# EAGLE design SMART4 (EAGLE 8.6.0)
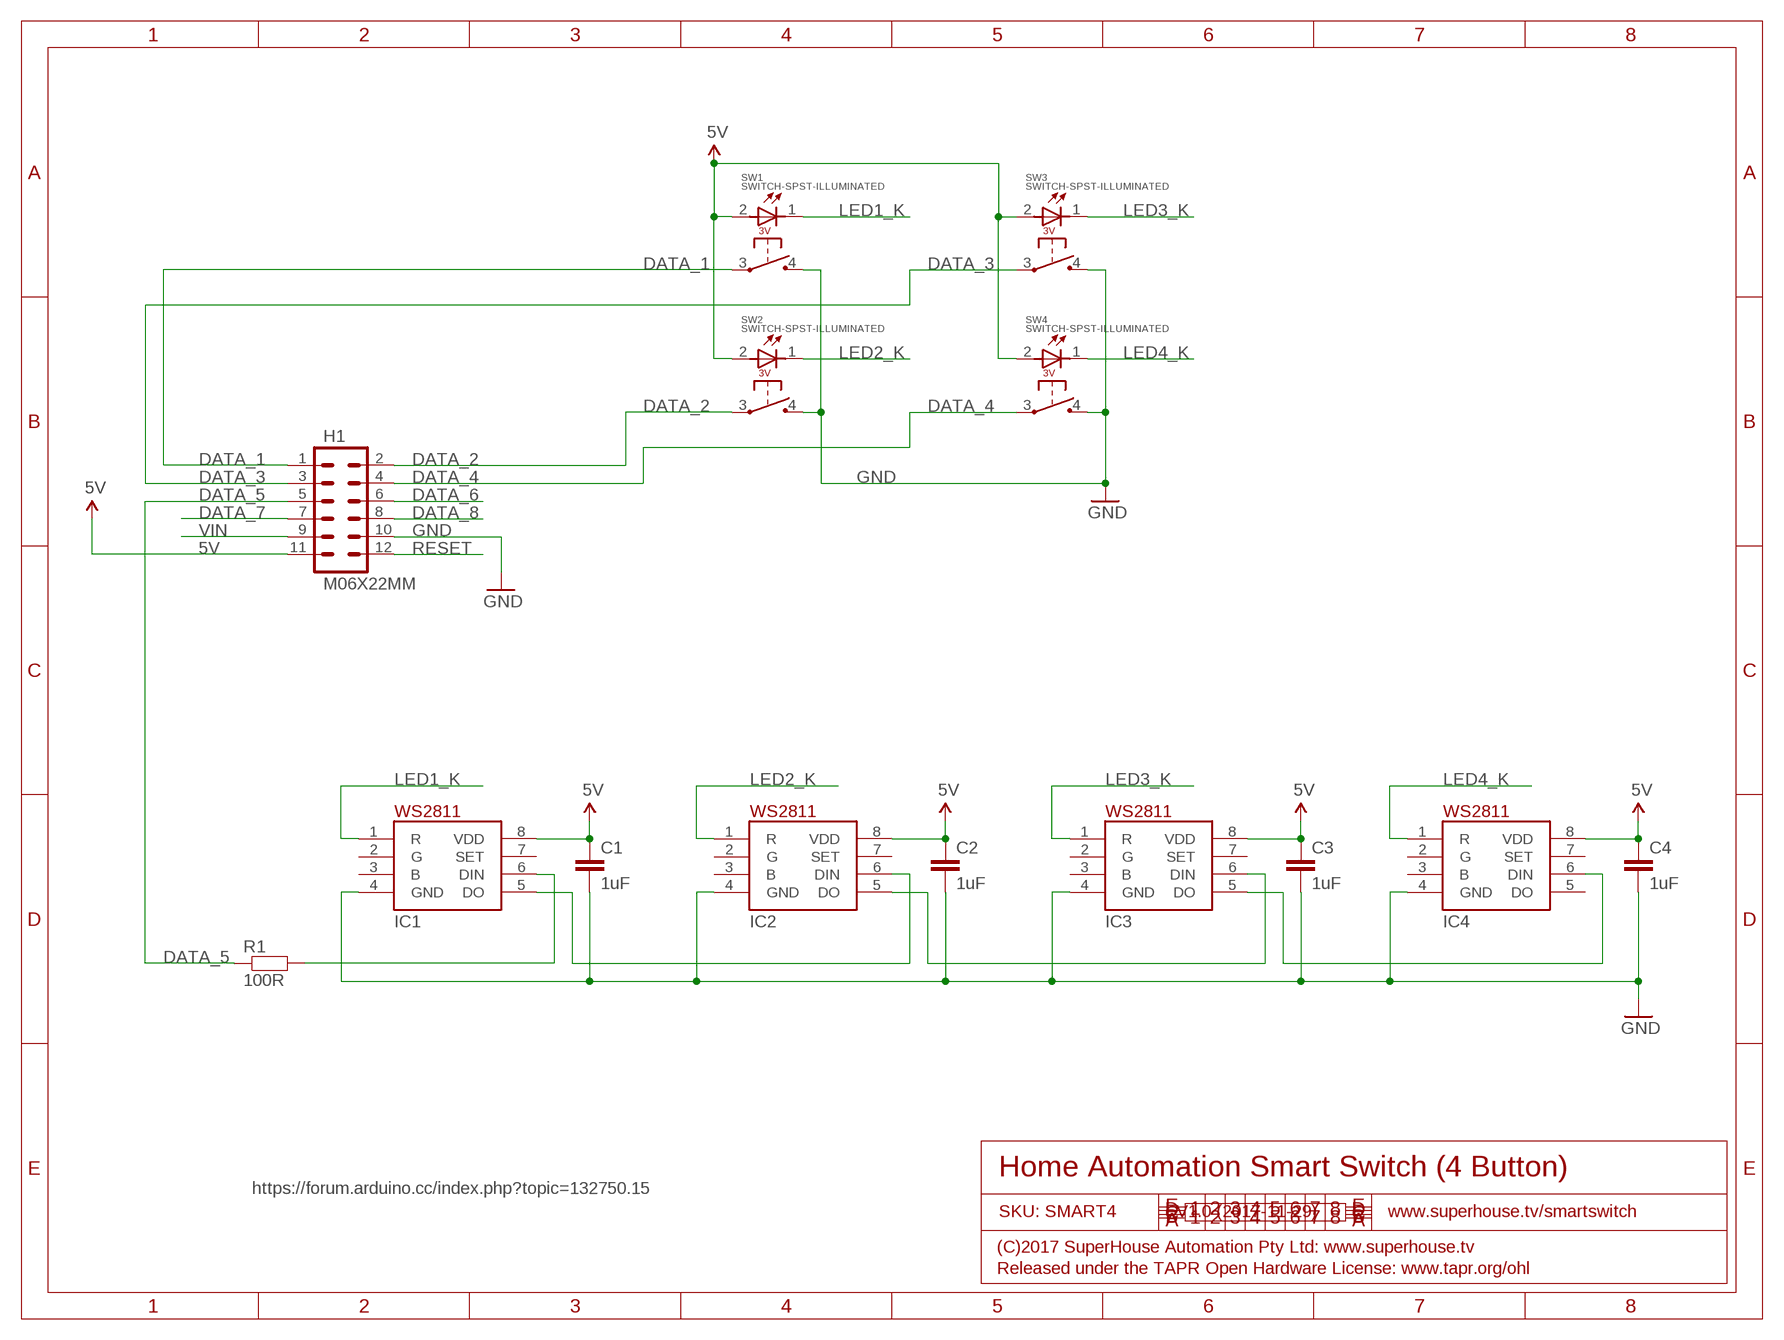
[diagram p0: schematic, sheet 1]

## Parts
C1  1uF  CAP0603  [0603]
C2  1uF  CAP0603  [0603]
C3  1uF  CAP0603  [0603]
C4  1uF  CAP0603  [0603]
H1  M06X22MM  [2X6-2MM]
IC1  WS2811-SOP8  [SO08-SKINNYPADS]
IC2  WS2811-SOP8  [SO08-SKINNYPADS]
IC3  WS2811-SOP8  [SO08-SKINNYPADS]
IC4  WS2811-SOP8  [SO08-SKINNYPADS]
R1  100R  RESISTOR0603  [0603]
SW1  SWITCH-SPST-ILLUMINATED  [SWITCH-SPST-ILLUMINATED]
SW2  SWITCH-SPST-ILLUMINATED  [SWITCH-SPST-ILLUMINATED]
SW3  SWITCH-SPST-ILLUMINATED  [SWITCH-SPST-ILLUMINATED]
SW4  SWITCH-SPST-ILLUMINATED  [SWITCH-SPST-ILLUMINATED]

## Nets
5V: C1.1 C2.1 C3.1 C4.1 H1.11 IC1.8(VDD) IC2.8(VDD) IC3.8(VDD) IC4.8(VDD) SW1.2(+) SW2.2(+) SW3.2(+) SW4.2(+)
DATA_1: H1.1 SW1.3(COM)
DATA_2: H1.2 SW2.3(COM)
DATA_3: H1.3 SW3.3(COM)
DATA_4: H1.4 SW4.3(COM)
DATA_5: H1.5 R1.1
DATA_6: H1.6
DATA_7: H1.7
DATA_8: H1.8
GND: C1.2 C2.2 C3.2 C4.2 H1.10 IC1.4(GND) IC2.4(GND) IC3.4(GND) IC4.4(GND) SW1.4(NO) SW2.4(NO) SW3.4(NO) SW4.4(NO)
LED1_K: IC1.1(R) SW1.1(-)
LED2_K: IC2.1(R) SW2.1(-)
LED3_K: IC3.1(R) SW3.1(-)
LED4_K: IC4.1(R) SW4.1(-)
N$1: IC1.6(DIN) R1.2
N$6: IC1.5(DO) IC2.6(DIN)
N$12: IC2.5(DO) IC3.6(DIN)
N$13: IC3.5(DO) IC4.6(DIN)
RESET: H1.12
VIN: H1.9
Unconnected: IC1.2(G) IC1.3(B) IC1.7(SET) IC2.2(G) IC2.3(B) IC2.7(SET) IC3.2(G) IC3.3(B) IC3.7(SET) IC4.2(G) IC4.3(B) IC4.5(DO) IC4.7(SET)

## Notes on the sheet
- Home Automation Smart Switch (4 Button)
- https://forum.arduino.cc/index.php?topic=132750.15
- SKU: SMART4 | V1.0 (2017-11-29) | www.superhouse.tv/smartswitch
- (C)2017 SuperHouse Automation Pty Ltd: www.superhouse.tv
- Released under the TAPR Open Hardware License: www.tapr.org/ohl

## Library data of the parts
C1-C4 = freetronics-jon:CAP: Capacitor Standard 0603 ceramic capacitor, and 0.1" leaded capacitor.
H1 = freetronics-jon:M06X2
IC1-IC4 = freetronics-jon:WS2811
R1 = freetronics-jon:RESISTOR: Resistor Basic schematic elements and footprints for 0603, 1206, and PTH 1/10th watt (small) resistors.
SW1-SW4 = freetronics-jon:SWITCH-SPST-ILLUMINATED

## Net classes
0 Default: width 0.203 mm
1 VCC: width 0.305 mm

## Board
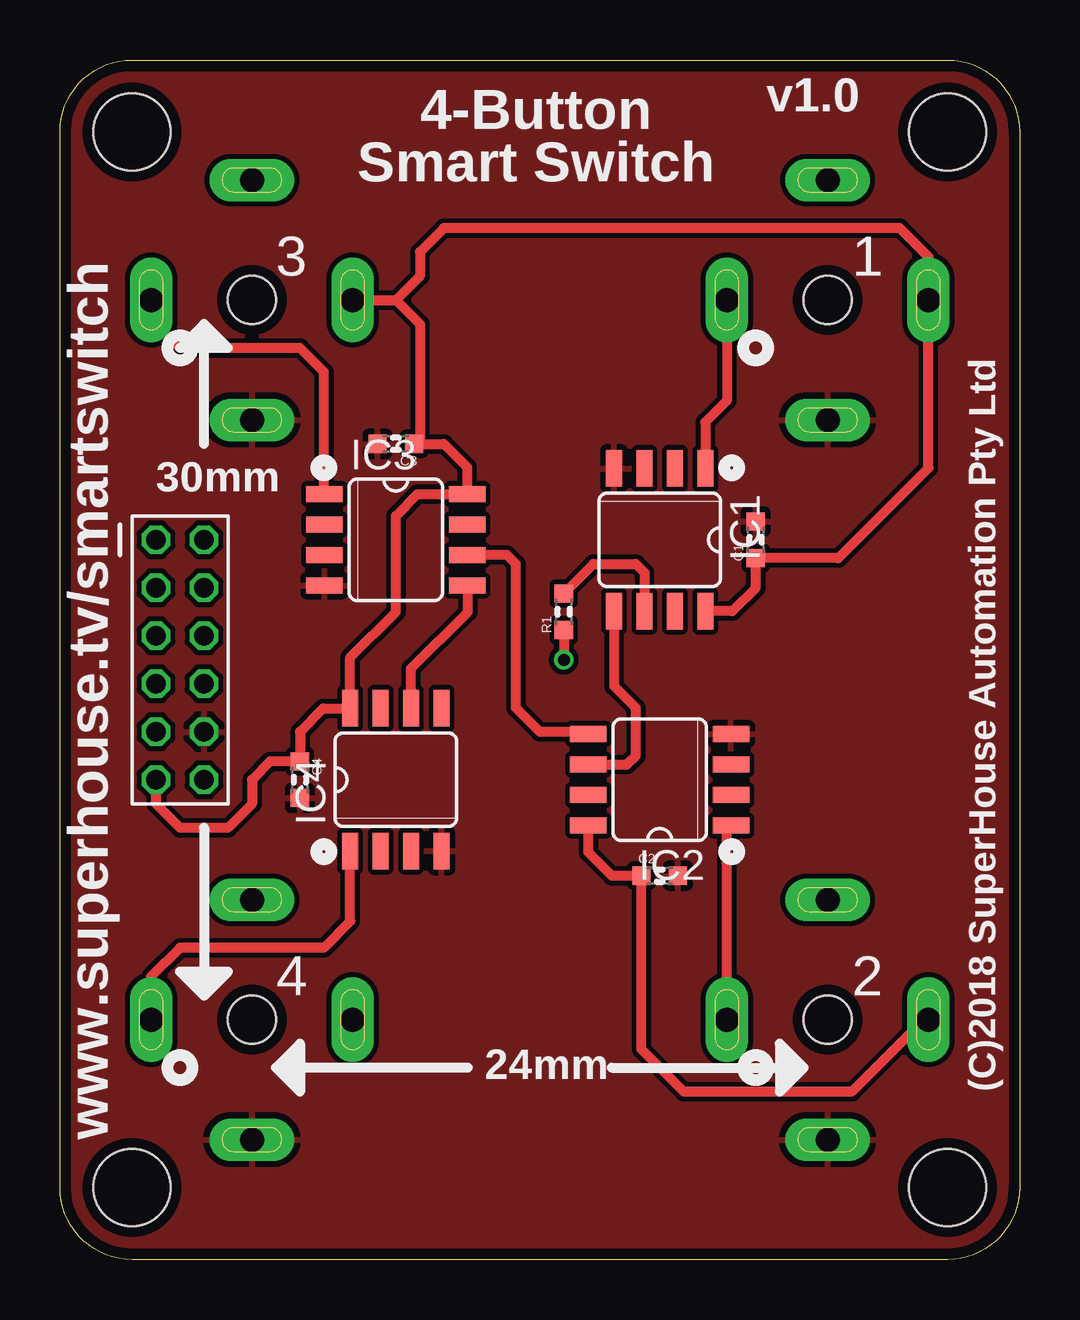
[diagram p1: board, top side]
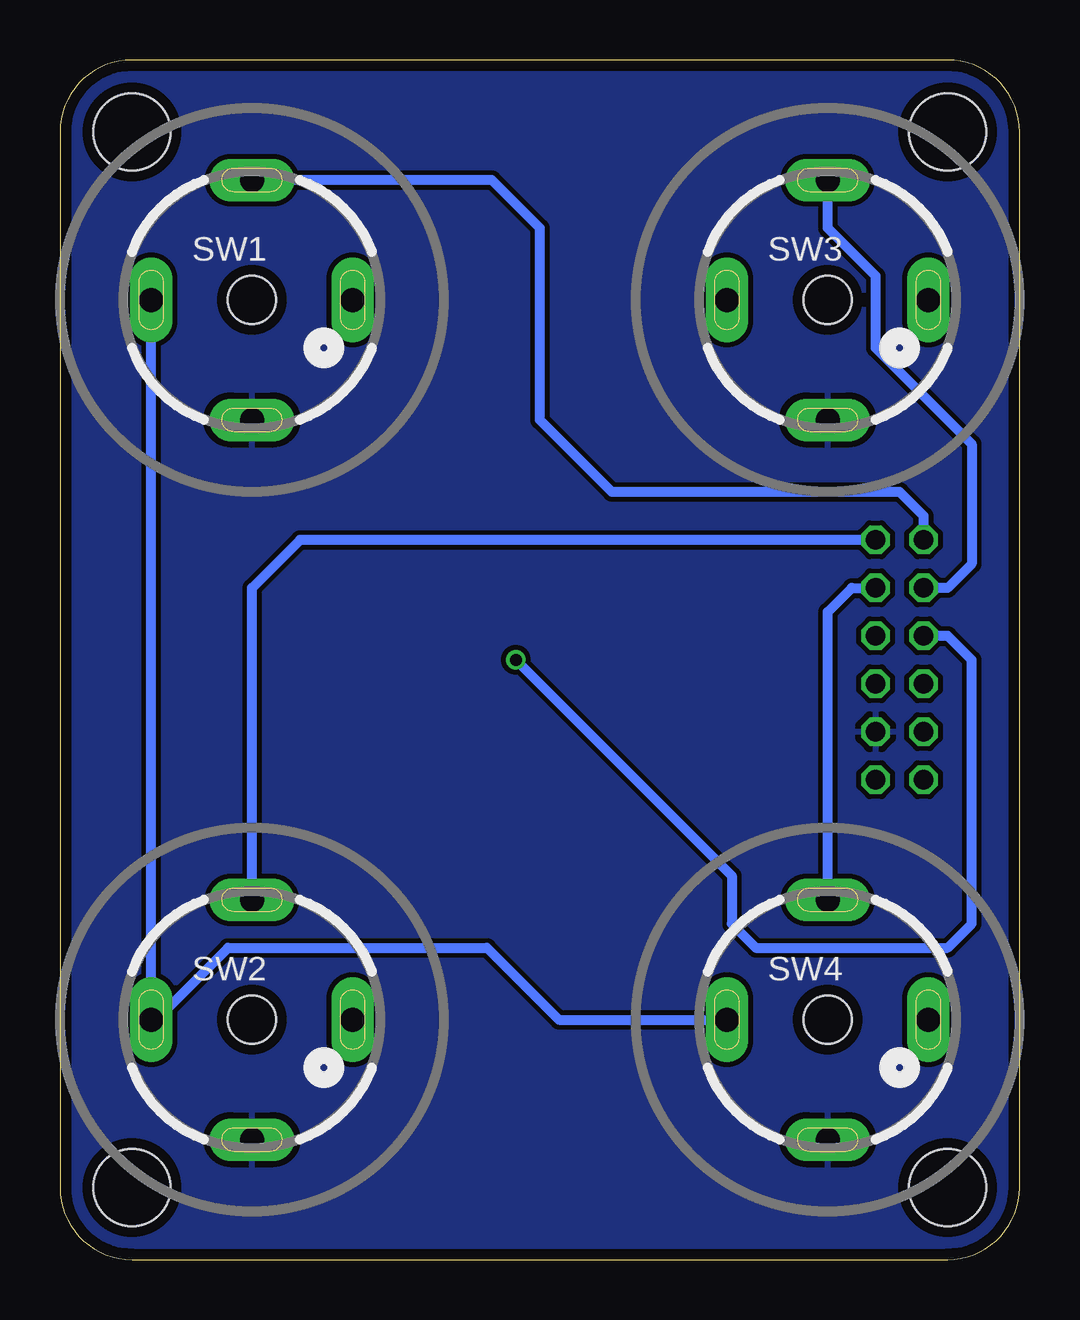
[diagram p2: board, bottom side, seen from below]

Size 40 x 50 mm. Coordinates in mm from the lower left corner, seen from the top.
Outline: 37,0 3,0 arc-90 0,3 0,47 arc-90 3,50 37,50 arc-90 40,47 40,3 arc-90 37,0
Copper layers (1*16): Top 0.035mm / dielectric 1.5mm / Bottom 0.035mm
Design rules "default *": minimum track width 8mil, minimum drill 15mil, track to track 8mil, track to pad 8mil, pad to pad 8mil, via to via 8mil, smd to smd 8mil, copper to edge 18mil, drill to drill 8mil, minimum pad ring 8mil, minimum via ring 6mil, stop-mask expansion 4mil, vias tented up to drill 25mil, thermal gap 10mil
Holes 2 mm at 8,10 32,10 32,40 8,40
Holes 3.2 mm at 3,3 3,47 37,47 37,3

### Footprints (pad centres in the part's own frame; a part is rotated, then mirrored left to right if it is on the bottom)
0603 = smd 0.762 x 0.762: 1 -0.762,0; 2 0.762,0
2X6-2MM = drill 0.8 octagon: 1 0,0; 2 2,0; 3 0,-2; 4 2,-2; 5 0,-4; 6 2,-4; 7 0,-6; 8 2,-6; 9 0,-8; 10 2,-8; 11 0,-10; 12 2,-10
SO08-SKINNYPADS = smd 0.66 x 1.524: 1 -1.905,-2.973; 2 -0.635,-2.973; 3 0.635,-2.973; 4 1.905,-2.973; 5 1.905,2.973; 6 0.635,2.973; 7 -0.635,2.973; 8 -1.905,2.973
SWITCH-SPST-ILLUMINATED = drill 1 pad 1.778 long: 1 4.2,0; 2 -4.2,0; 3 0,5; 4 0,-5

### Placement (x,y rotation side)
C1  29,30 90 top
C2  25,16 0 top
C3  14,34 180 top
C4  10,20 270 top
H1  4,30 0 top
IC1  25,30 180 top
IC2  25,20 90 top
IC3  14,30 270 top
IC4  14,20 0 top
R1  21,27 90 top
SW1  32,40 0 bottom
SW2  32,10 0 bottom
SW3  8,40 0 bottom
SW4  8,10 0 bottom

### Tracks (layer width: path | path; a pad name or v marks a point on that pad's centre or on a via)
5V
  Top 0.406: IC1.8 28.03,27.03 29,28 C1.1 32.44,29.24 36.2,33 SW1.2 36.2,41.8 35,43 16,43 15,42 15,41 14,40 | IC2.8 22.03,16.97 23,16 C2.1 24.24,8.76 26,7 33,7 36,10 SW2.2 | SW3.2 14,40 | 14,40 15,39 15,34.24 C3.1 16,34 16.97,33.03 IC3.8 14.9,31.91 14,31 14,27 12.1,25.09 IC4.8 10.97,22.97 10,22 C4.1 8.76,20.76 8,20 8,19 7,18 5,18 4,19 H1.11
  Bottom 0.406: SW1.2 SW2.2 36,10 33,13 22.2,13 19.2,10 SW4.2
DATA_1
  Bottom 0.406: SW1.3 22,45 20,43 20,35 17,32 5,32 4,31 H1.1
DATA_2
  Bottom 0.406: SW2.3 32,28 30,30 H1.2
DATA_3
  Bottom 0.406: H1.3 3,28 2,29 2,34 6,38 6,41 8,43 SW3.3
DATA_4
  Bottom 0.406: SW4.3 8,27 7,28 H1.4
DATA_5  (via drill 0.5)
  Top 0.406: R1.1 v21,25
  Bottom 0.406: H1.5 3,26 2,25 2,14 3,13 11,13 12,14 12,16 v21,25
GND
  pour Top: 37,50 3,50 arc90 0,47 0,3 arc90 3,0 37,0 arc90 40,3 40,47 arc90
  pour Bottom: 37,50 3,50 arc90 0,47 0,3 arc90 3,0 37,0 arc90 40,3 40,47 arc90
LED1_K
  Top 0.406: IC1.1 26.91,34.91 27.8,35.8 SW1.1
LED2_K
  Top 0.406: SW2.1 27.8,17.92 IC2.1
LED3_K
  Top 0.406: IC3.1 11,31.93 11,37 10,38 5,38 3.8,39.2 SW3.1
LED4_K
  Top 0.406: IC4.1 12.1,14.1 11,13 5,13 3.8,11.8 SW4.1
N$1
  Top 0.406: R1.2 22.24,29 24,29 24.36,28.64 IC1.6
N$6
  Top 0.406: IC1.5 23.09,23.91 24,23 24,21 23.64,20.64 IC2.6
N$12
  Top 0.406: IC2.5 21.93,22 20,22 19,23 19,29 18.64,29.36 IC3.6
N$13
  Top 0.406: IC4.6 14.63,24.64 17,27 17,28.07 IC3.5

### Text on the board
tPlace: v1.0 | 4-Button / Smart Switch | 3 | 1 | 30mm | 4 | 2 | 24mm | (C)2018 SuperHouse Automation Pty Ltd | www.superhouse.tv/smartswitch